# Altium schematic sheet bandpass_filter.SchDoc
size A3; SheetNumber: 7; SheetTotal: 7
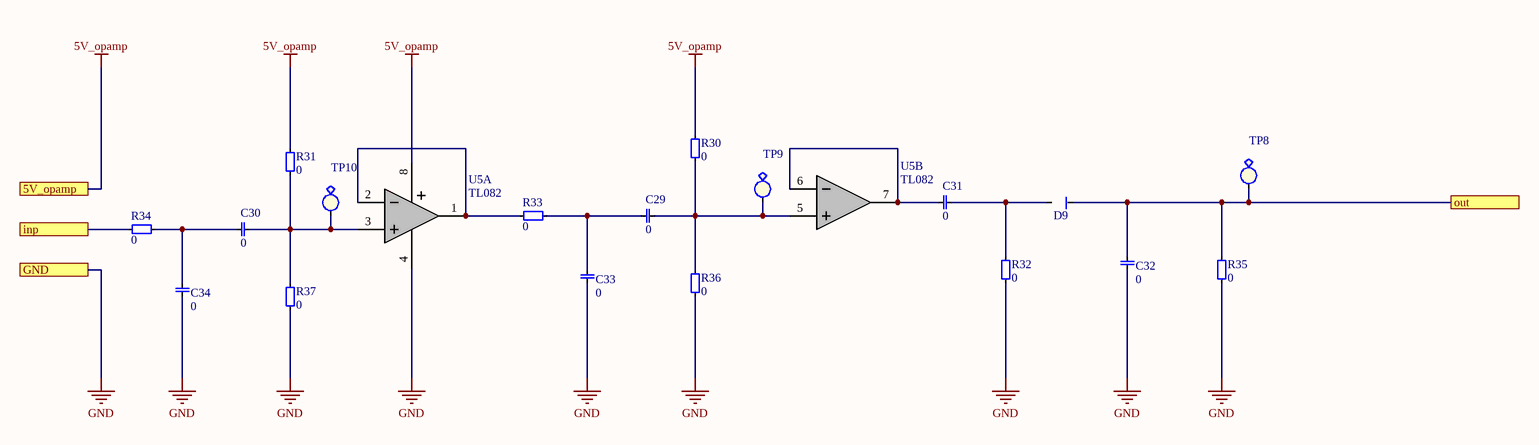
[diagram p0: bandpass_filter.SchDoc]

## Parts
C29  value 0  [1206, capasitor]  (hidden comment: 1206, capacitor)
C30  value 0  [1206, capasitor]  (hidden comment: 1206, capacitor)
C31  value 0  [1206, capasitor]  (hidden comment: 1206, capacitor)
C32  value 0  [1206, capasitor]  (hidden comment: 1206, capacitor)
C33  value 0  [1206, capasitor]  (hidden comment: 1206, capacitor)
C34  value 0  [1206, capasitor]  (hidden comment: 1206, capacitor)
D9  Diode, TH  [TO-220-F2]  (value not drawn)
R30  value 0  [1206]  (hidden comment: 1206, resistor)
R31  value 0  [1206]  (hidden comment: 1206, resistor)
R32  value 0  [1206]  (hidden comment: 1206, resistor)
R33  value 0  [1206]  (hidden comment: 1206, resistor)
R34  value 0  [1206]  (hidden comment: 1206, resistor)
R35  value 0  [1206]  (hidden comment: 1206, resistor)
R36  value 0  [1206]  (hidden comment: 1206, resistor)
R37  value 0  [1206]  (hidden comment: 1206, resistor)
TP8  Test Point  [testPoint]  (value not drawn)
TP9  Test Point  [testPoint]  (value not drawn)
TP10  Test Point  [testPoint]  (value not drawn)
U5  TL082  [SOIC8]  (parts A,B of 2)

## Ports
5V_opamp, GND, inp, out

## Nets
5V_opamp: R30.0 R31.0 U5.8(V+) ; port 5V_opamp
GND: C32.0 C33.0 C34.0 R32.1 R35.1 R36.1 R37.1 U5.4(V-) ; port GND
inp: R34.1 ; port inp
out: C32.1 D9.1 R35.0 TP8.0 ; port out
NetC29_0: C29.0 R30.1 R36.0 TP9.0 U5.5(IN+)
NetC29_1: C29.1 C33.1 R33.0
NetC30_0: C30.0 R31.1 R37.0 TP10.0 U5.3(IN+)
NetC30_1: C30.1 C34.1 R34.0
NetC31_0: C31.0 D9.2 R32.0
NetC31_1: C31.1 U5.6(IN-) U5.7(OUT2)
NetR33_1: R33.1 U5.1(OUT1) U5.2(IN-)

## Library data of the parts
R30-R37 = 1206, resistor: Resistor
U5 = TL082: Dual FET-Input Operational Amplifier; Digikey: TL082CM/NOPB-ND
TP8-TP10 = Test Point: Value: Test point; Farnell: 1702006